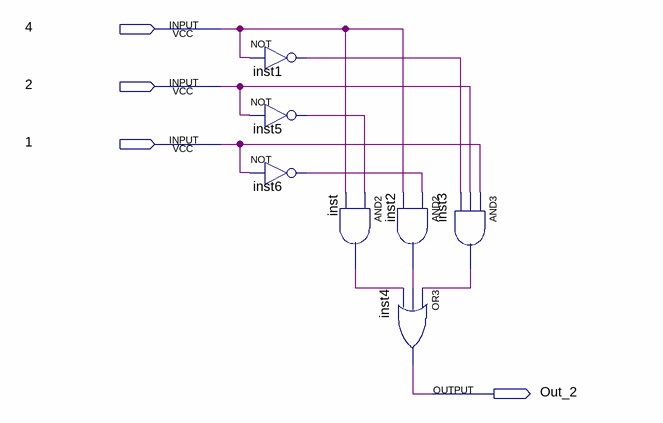
[diagram p0: schematic sheet]
// Quartus schematic D2.bdf as structural Verilog: 7 symbols, 4 pins
module D2 (
  input  \4 ,
  input  \2 ,
  input  \1 ,
  output Out_2
);

  wire inst1_out, inst2_out, inst3_out, inst5_out, inst6_out, inst_out;

  not inst1 (inst1_out, \4 );
  not inst5 (inst5_out, \2 );
  not inst6 (inst6_out, \1 );
  and inst (inst_out, inst5_out, \4 );
  and inst2 (inst2_out, inst6_out, \4 );
  or inst4 (Out_2, inst3_out, inst2_out, inst_out);
  and inst3 (inst3_out, \1 , \2 , inst1_out);
endmodule
